# Altium schematic sheet XC7A35TFTG256_bank15.SchDoc
size A4; DocumentNumber: 18; SheetNumber: 18; SheetTotal: 21; SheetName: FPGA Bank 15
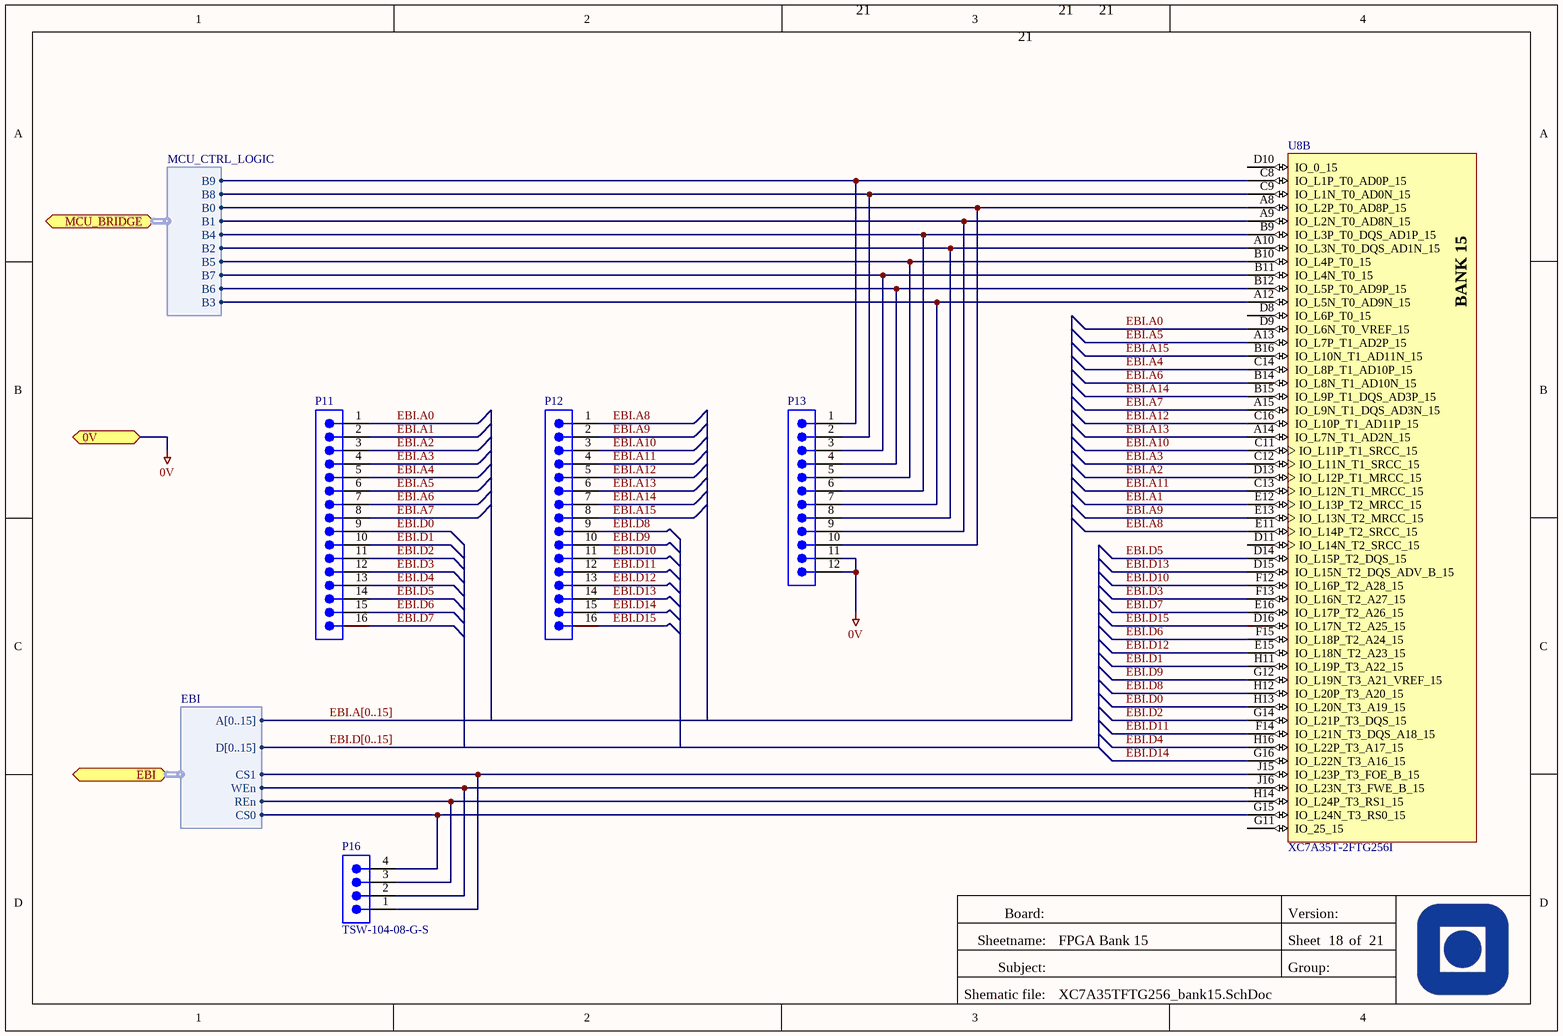
[diagram p0: XC7A35TFTG256_bank15.SchDoc]

## Parts
P11  MTLW-116-07-F-S-265  [SMTC-MTLW-116-07-X-S-265]  (value not drawn)
P12  MTLW-116-07-F-S-265  [SMTC-MTLW-116-07-X-S-265]  (value not drawn)
P13  MTLW-112-07-L-S-125  [SMTC-MTLW-112-07-X-S-125]  (value not drawn)
P16  TSW-104-08-G-S  [SMTC-TSW-104-08-X-S]
U8  XC7A35T-2FTG256I  [FTG256]  (part B of 8)

## Ports
0V, EBI (harness EBI), MCU_BRIDGE (harness MCU_CTRL_LOGIC)

## Harnesses
EBI: A[0..15], D[0..15], CS0, CS1, REn, WEn
MCU_CTRL_LOGIC: B0, B1, B2, B3, B4, B5, B6, B7, B8, B9

## Nets
0V: P13.11 P13.12 ; port 0V
EBI.A0: P11.1 U8.D9(IO_L6N_T0_VREF_15)
EBI.A1: P11.2 U8.E12(IO_L13P_T2_MRCC_15)
EBI.A2: P11.3 U8.D13(IO_L12P_T1_MRCC_15)
EBI.A3: P11.4 U8.C12(IO_L11N_T1_SRCC_15)
EBI.A4: P11.5 U8.C14(IO_L8P_T1_AD10P_15)
EBI.A5: P11.6 U8.A13(IO_L7P_T1_AD2P_15)
EBI.A6: P11.7 U8.B14(IO_L8N_T1_AD10N_15)
EBI.A7: P11.8 U8.A15(IO_L9N_T1_DQS_AD3N_15)
EBI.A8: P12.1 U8.E11(IO_L14P_T2_SRCC_15)
EBI.A9: P12.2 U8.E13(IO_L13N_T2_MRCC_15)
EBI.A10: P12.3 U8.C11(IO_L11P_T1_SRCC_15)
EBI.A11: P12.4 U8.C13(IO_L12N_T1_MRCC_15)
EBI.A12: P12.5 U8.C16(IO_L10P_T1_AD11P_15)
EBI.A13: P12.6 U8.A14(IO_L7N_T1_AD2N_15)
EBI.A14: P12.7 U8.B15(IO_L9P_T1_DQS_AD3P_15)
EBI.A15: P12.8 U8.B16(IO_L10N_T1_AD11N_15)
EBI.D0: P11.9 U8.H13(IO_L20N_T3_A19_15)
EBI.D1: P11.10 U8.H11(IO_L19P_T3_A22_15)
EBI.D2: P11.11 U8.G14(IO_L21P_T3_DQS_15)
EBI.D3: P11.12 U8.F13(IO_L16N_T2_A27_15)
EBI.D4: P11.13 U8.H16(IO_L22P_T3_A17_15)
EBI.D5: P11.14 U8.D14(IO_L15P_T2_DQS_15)
EBI.D6: P11.15 U8.F15(IO_L18P_T2_A24_15)
EBI.D7: P11.16 U8.E16(IO_L17P_T2_A26_15)
EBI.D8: P12.9 U8.H12(IO_L20P_T3_A20_15)
EBI.D9: P12.10 U8.G12(IO_L19N_T3_A21_VREF_15)
EBI.D10: P12.11 U8.F12(IO_L16P_T2_A28_15)
EBI.D11: P12.12 U8.F14(IO_L21N_T3_DQS_A18_15)
EBI.D12: P12.13 U8.E15(IO_L18N_T2_A23_15)
EBI.D13: P12.14 U8.D15(IO_L15N_T2_DQS_ADV_B_15)
EBI.D14: P12.15 U8.G16(IO_L22N_T3_A16_15)
EBI.D15: P12.16 U8.D16(IO_L17N_T2_A25_15)
NetP13_1: P13.1 U8.C8(IO_L1P_T0_AD0P_15) ; port MCU_BRIDGE.B9
NetP13_2: P13.2 U8.C9(IO_L1N_T0_AD0N_15) ; port MCU_BRIDGE.B8
NetP13_3: P13.3 U8.B11(IO_L4N_T0_15) ; port MCU_BRIDGE.B7
NetP13_4: P13.4 U8.B12(IO_L5P_T0_AD9P_15) ; port MCU_BRIDGE.B6
NetP13_5: P13.5 U8.B10(IO_L4P_T0_15) ; port MCU_BRIDGE.B5
NetP13_6: P13.6 U8.B9(IO_L3P_T0_DQS_AD1P_15) ; port MCU_BRIDGE.B4
NetP13_7: P13.7 U8.A12(IO_L5N_T0_AD9N_15) ; port MCU_BRIDGE.B3
NetP13_8: P13.8 U8.A10(IO_L3N_T0_DQS_AD1N_15) ; port MCU_BRIDGE.B2
NetP13_9: P13.9 U8.A9(IO_L2N_T0_AD8N_15) ; port MCU_BRIDGE.B1
NetP13_10: P13.10 U8.A8(IO_L2P_T0_AD8P_15) ; port MCU_BRIDGE.B0
NetP16_1: P16.1 U8.J15(IO_L23P_T3_FOE_B_15) ; port EBI.CS1
NetP16_2: P16.2 U8.J16(IO_L23N_T3_FWE_B_15) ; port EBI.WEn
NetP16_3: P16.3 U8.H14(IO_L24P_T3_RS1_15) ; port EBI.REn
NetP16_4: P16.4 U8.G15(IO_L24N_T3_RS0_15) ; port EBI.CS0

Not connected (* = marked no-connect by the designer): U8 D8(IO_L6P_T0_15) D10(IO_0_15) D11(IO_L14N_T2_SRCC_15) G11(IO_25_15)

## Buses and harness runs
bus EBI.A[0..15]
bus EBI.D[0..15]

## Notes on the sheet
- Board:
- Version:
- Sheetname:
- Subject:
- Group:
- Sheet
- of
- Shematic file:
- (in symbol CMP-0383-00025-1, part B) BANK 15

## Library data of the parts
P11 P12 = CMP-1024-00094-1: Manufacturer: Samtec; Pitch: 2.54 mm; Temperature Range: -55 to 125 degC; ComponentLink2URL: http://www.samtec.com/documents/webfiles/pdf/MTLW_TH.PDF; ComponentLink3URL: http://www.samtec.com/documents/webfiles/cpdf/MTLW-1XX-XX-XX-X-XXX-XX-XX-MKT1.pdf; PackageVersion: T, 6/1991; ComponentLink1Description: Manufacturer URL; PackageDescription: Low Profile Terminal Assembly; RoHS: True; ComponentLink2Description: Datasheet; PackageReference: MTLW-116-07-X-S-265; PartNumber: MTLW-116-07-F-S-265; Mounting Technology: Through-hole; DatasheetVersion: F-214; Orientation: Vertical; ComponentLink3Description: Package Specification; ComponentLink1URL: http://www.samtec.com
P13 = CMP-1024-00087-1: Manufacturer: Samtec; Pitch: 2.54 mm; Mounting Technology: Through-hole; ComponentLink2URL: http://www.samtec.com/documents/webfiles/pdf/MTLW_TH.PDF; Temperature Range: -55 to 125 degC; PackageVersion: T, 6/1991; ComponentLink3Description: Package Specification; DatasheetVersion: F-214; PartNumber: MTLW-112-07-L-S-125; ComponentLink1URL: http://www.samtec.com; PackageReference: MTLW-112-07-X-S-125; ComponentLink3URL: http://www.samtec.com/documents/webfiles/cpdf/MTLW-1XX-XX-XX-X-XXX-XX-XX-MKT1.pdf; PackageDescription: Low Profile Terminal Assembly; ComponentLink1Description: Manufacturer URL; RoHS: True; ComponentLink2Description: Datasheet; Orientation: Vertical
P16 = CMP-1024-00357-1: 0.025" SQ Post Header, Through-hole, Vertical, -55 to 125 degC, 2.54 mm Pitch, 4-Pin, Male, RoHS; Manufacturer: Samtec; Pitch: 2.54 mm; RoHS: True; ComponentLink3URL: http://www.samtec.com/documents/webfiles/cpdf/TSW-XXX-XX-XXX-X-XX-XXX-MKT.pdf; Mounting Technology: Through-hole; ComponentLink2URL: http://www.samtec.com/documents/webfiles/pdf/TSW_TH.PDF; ComponentLink1URL: http://www.samtec.com; ComponentLink3Description: Package Specification; PackageVersion: DM, 8/1988; ComponentLink2Description: Datasheet; PackageReference: TSW-104-08-X-S; PackageDescription: .025[0.64] SQ. Post Terminal Strip Assembly; PartNumber: TSW-104-08-G-S; ComponentLink1Description: Manufacturer URL; Temperature Range: -55 to 125 degC; DatasheetVersion: F-214; Orientation: Vertical
U8 = CMP-0383-00025-1: Artix-7 FPGA, 170 User I/Os, 0 GTP, 256-Ball BGA, Speed Grade 2, Industrial Grade, Pb-Free; Manufacturer: Xilinx; Logic Cells: 33280; GTP: 0; CMTs: 5; Available User I/O: 170; Total Block RAM: 1800 Kb; Speed Grades: 2; ComponentLink3Description: Pinout; ComponentLink4Description: Package Specification; ComponentLink2URL: http://www.xilinx.com/support/documentation/data_sheets/ds180_7Series_Overview.pdf; DatasheetVersion: Rev. 1.15; PackageVersion: Rev. 1.11; ComponentLink3URL: http://www.xilinx.com/support/documentation/user_guides/ug475_7Series_Pkg_Pinout.pdf; ComponentLink1Description: Manufacturer URL; PackageReference: FTG-256; ComponentLink1URL: http://www.xilinx.com/; ComponentLink4URL: http://www.xilinx.com/support/documentation/user_guides/ug475_7Series_Pkg_Pinout.pdf; Mounting Technology: Surface Mount; Maximum Distributed RAM: 400 Kb; PackageDescription: 256-Ball Wire-Bond Fine-Pitch Thin BGA, Body 17 x 17 mm, Pitch 1 mm; ComponentLink2Description: Datasheet; Operating Temperature Range: Industrial; PartNumber: XC7A35T-2FTG256I; PartId: 1